# Altium schematic sheet Power.SchDoc
size A4
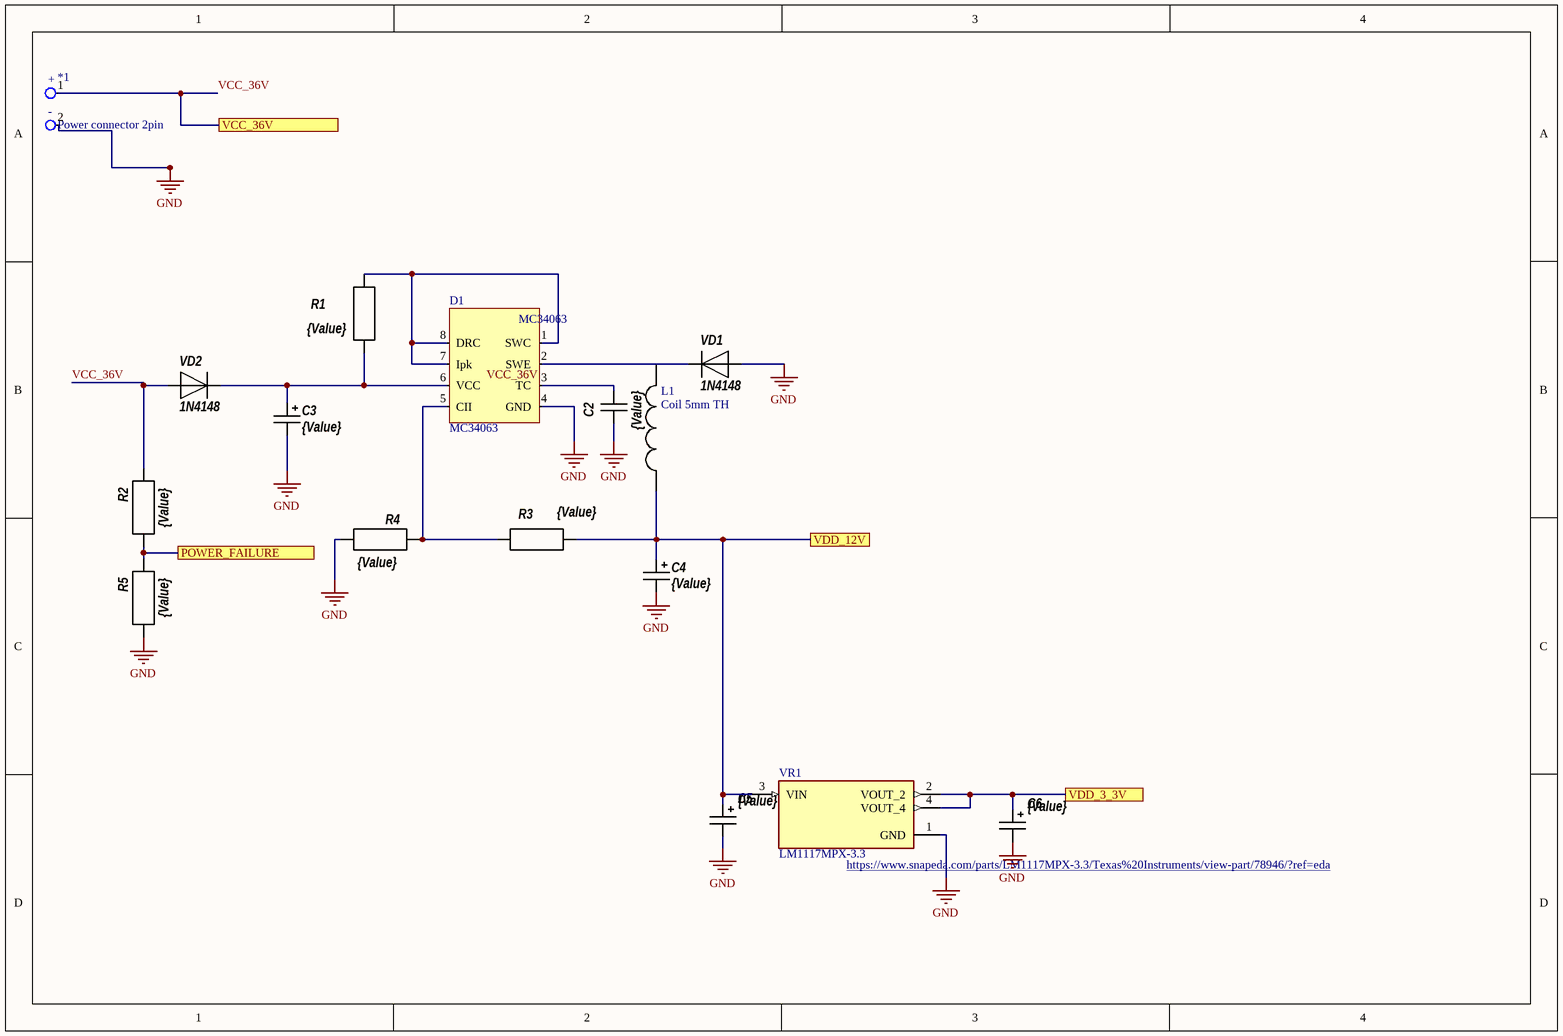
[diagram p0: Power.SchDoc]

## Parts
*1  Power connector 2pin  [Power connector 2 pin]
C2  value {Value}  [R0805]  (hidden comment: Cap 0805)
C3  value {Value}  [Cap Alum 8x10.5 mm]  (hidden comment: 100 uF 50V)
C4  value {Value}  [Cap Alum 8x10.5 mm]  (hidden comment: 100 uF 50V)
C5  value {Value}  [Tantal type B]  (hidden comment: Cap tan_B)
C6  value {Value}  [Tantal type B]  (hidden comment: Cap tan_B)
D1  MC34063  [MC34063]
L1  Coil 5mm TH  [Coil 5mm TH]
R1  value {Value}  [R0805]  (hidden comment: Res 0805)
R2  value {Value}  [R0805]  (hidden comment: Res 0805)
R3  value {Value}  [R0805]  (hidden comment: Res 0805)
R4  value {Value}  [R0805]  (hidden comment: Res 0805)
R5  value {Value}  [R0805]  (hidden comment: Res 0805)
VD1  1N4148  [SOD-80]
VD2  1N4148  [SOD-80]
VR1  LM1117MPX-3.3  [VREG_LM1117MPX-3.3]

## Ports
POWER_FAILURE, VCC_36V, VDD_3_3V, VDD_12V

## Nets
GND: *1.2 C2.2 C3.2 C4.2 C5.2 C6.2 D1.4(GND) R4.1 R5.1 VD1.1 VR1.1(GND)
POWER_FAILURE: R2.1 R5.2 ; port POWER_FAILURE
VCC_36V: *1.1 R2.2 VD2.1 ; port VCC_36V
VDD_3_3V: C6.1 VR1.2(VOUT_2) VR1.4(VOUT_4) ; port VDD_3_3V
VDD_12V: C4.1 C5.1 L1.1 R3.1 VR1.3(VIN) ; port VDD_12V
NetC2_1: C2.1 D1.3(TC)
NetC3_1: C3.1 D1.6(VCC) R1.2 VD2.2
NetD1_1: D1.1(SWC) D1.7(Ipk) D1.8(DRC) R1.1
NetD1_2: D1.2(SWE) L1.2 VD1.2
NetD1_5: D1.5(CII) R3.2 R4.2

## Notes on the sheet
- Labels drawn without touching a wire or pin: VCC_36V
- (in symbol Power connector 2pin) +; -

## Library data of the parts
C2 = Cap 0805: Конденсатор 0805; Manufacturer: Murata; sm_pins: 2; th_pins: 0; Model: 0805
C3 C4 = Cap Alum: SMT 8 x 10.5 мм; Manufacturer: Epcos
C5 C6 = Cap tan_B: type B; Manufacturer: AVX
R1-R5 = Res 0805: Резистор 0805; Manufacturer: Yageo; sm_pins: 2; th_pins: 0; Model: *
VD1 VD2 = 1N4148: 4 ns, 100V, 150 mA; Manufacturer: NXP; Model: 1N4148
VR1 = LM1117MPX-3.3: 800-mA 15-V linear voltage regulator 4-SOT-223; MF: Texas Instruments; Price: None; Value: *; Package: SOT-223-4 Texas Instruments; SnapEDA_Link: https://www.snapeda.com/parts/LM1117MPX-3.3/Texas%20Instruments/view-part/78946/?ref=snap; Mouser-Purchase-URL: https://snapeda.com/shop?store=Mouser&id=78946; Availability: Warning; Texas_Instruments-Purchase-URL: https://snapeda.com/shop?store=Texas+Instruments&id=78946; MP: LM1117MPX-3.3; Check_prices: https://www.snapeda.com/parts/LM1117MPX-3.3/Texas%20Instruments/view-part/78946/?ref=eda